# Altium schematic sheet Sheet0.SchDoc
size A4
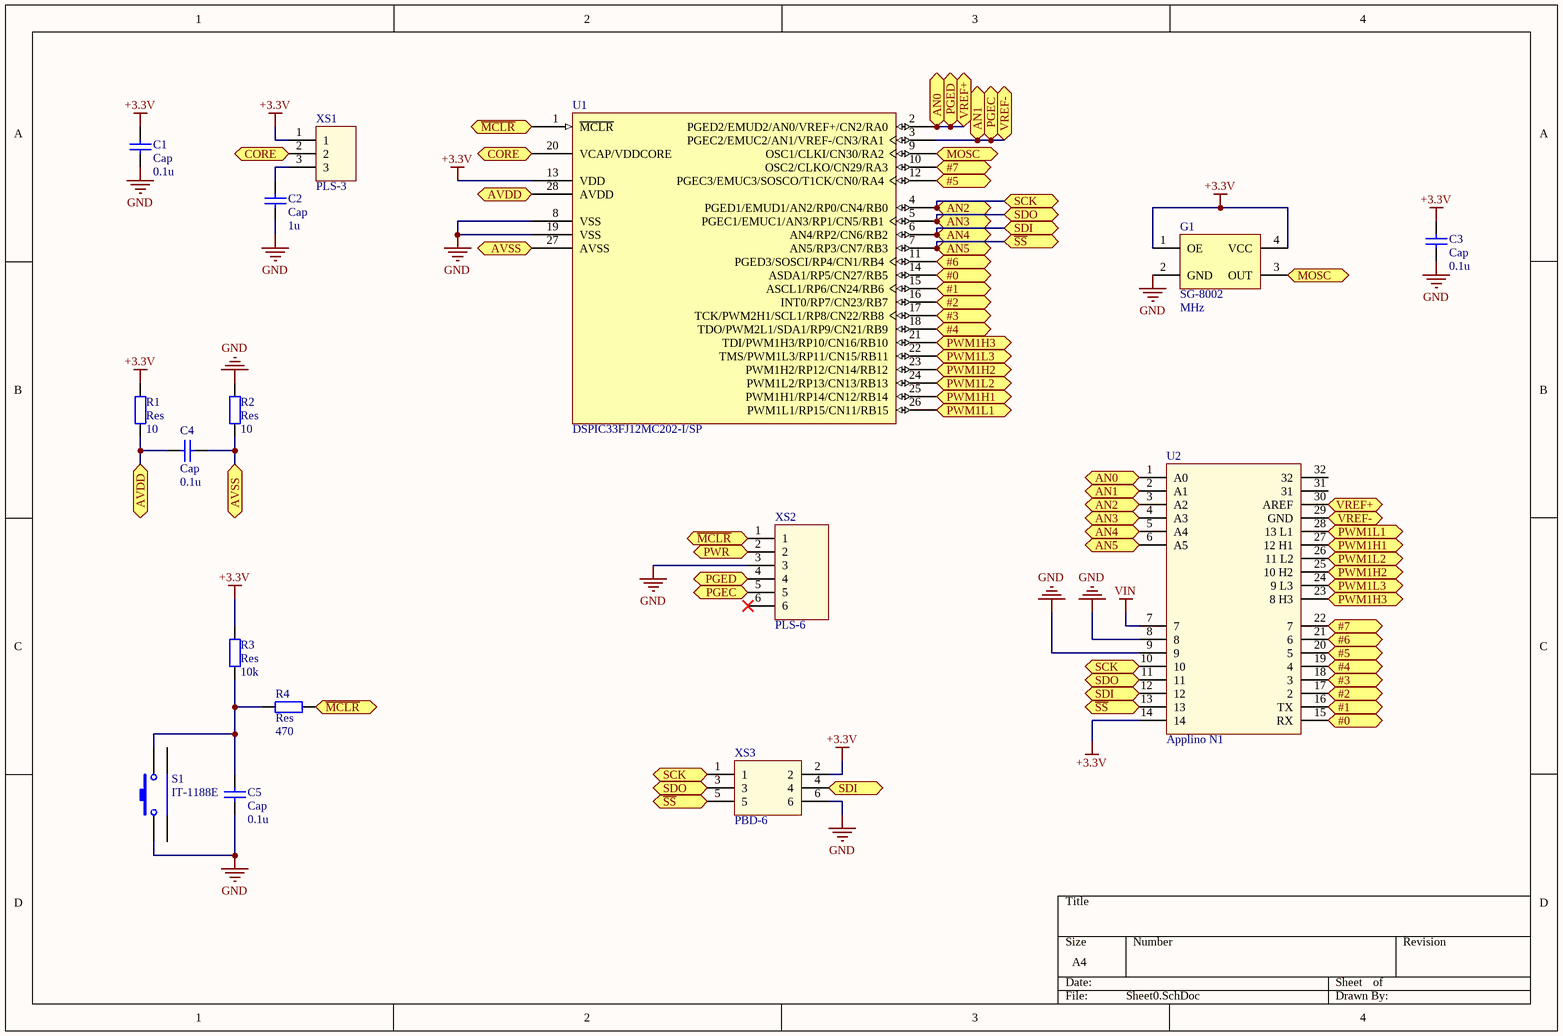
[diagram p0: Sheet0.SchDoc]

## Parts
C1  Cap  value 0.1u  [0805]
C2  Cap  value 1u  [0805]
C3  Cap  value 0.1u  [0805]
C4  Cap  value 0.1u  [0805]
C5  Cap  value 0.1u  [0805]
G1  SG-8002  Frequency: MHz  [SMD7050]
R1  Res  value 10  [0805]
R2  Res  value 10  [0805]
R3  Res  value 10k  [0805]
R4  Res  value 470  [0805]
S1  IT-1188E  [IT-1188E]
U1  DSPIC33FJ12MC202-I/SP  [SPDIP300-SP28]
U2  Applino N1  [N1]
XS1  PLS-3  [PLS-3]
XS2  PLS-6  [PLS-6]
XS3  PBD-6  [PBD-6]

## Ports
#0, #1, #2, #3, #4, #5, #6, #7, AN0, AN1, AN2, AN3, AN4, AN5, AVDD, AVSS, CORE, MOSC, PGEC, PGED, PWM1H1, PWM1H2, PWM1H3, PWM1L1, PWM1L2, PWM1L3, PWR, SCK, SDI, SDO, VREF+, VREF-, ~{MCLR}, ~{SS}

## Nets
+3.3V: C1.2 C3.2 G1.1(OE) G1.4(VCC) R1.2 R3.2 U1.13(VDD) U2.14 XS1.1 XS3.2
GND: C1.1 C2.1 C3.1 C5.1 G1.2(GND) R2.2 S1.1 U1.8(VSS) U1.19(VSS) U2.8 U2.9 XS2.3 XS3.6
VIN: U2.7
#0: U1.14(ASDA1/RP5/CN27/RB5) U2.15(RX) ; port #0
#1: U1.15(ASCL1/RP6/CN24/RB6) U2.16(TX) ; port #1
#2: U1.16(INT0/RP7/CN23/RB7) U2.17(2) ; port #2
#3: U1.17(TCK/PWM2H1/SCL1/RP8/CN22/RB8) U2.18(3) ; port #3
#4: U1.18(TDO/PWM2L1/SDA1/RP9/CN21/RB9) U2.19(4) ; port #4
#5: U1.12(PGEC3/EMUC3/SOSCO/T1CK/CN0/RA4) U2.20(5) ; port #5
#6: U1.11(PGED3/SOSCI/RP4/CN1/RB4) U2.21(6) ; port #6
#7: U1.10(OSC2/CLKO/CN29/RA3) U2.22(7) ; port #7
AN0: U1.2(PGED2/EMUD2/AN0/VREF+/CN2/RA0) U2.1(A0) U2.30(AREF) XS2.4 ; port PGED, port AN0, port VREF+
AN1: U1.3(PGEC2/EMUC2/AN1/VREF-/CN3/RA1) U2.2(A1) U2.29(GND) XS2.5 ; port PGEC, port AN1, port VREF-
AN2: U1.4(PGED1/EMUD1/AN2/RP0/CN4/RB0) U2.3(A2) U2.10 XS3.1 ; port AN2, port SCK
AN3: U1.5(PGEC1/EMUC1/AN3/RP1/CN5/RB1) U2.4(A3) U2.11 XS3.3 ; port AN3, port SDO
AN4: U1.6(AN4/RP2/CN6/RB2) U2.5(A4) U2.12 XS3.4 ; port AN4, port SDI
AN5: U1.7(AN5/RP3/CN7/RB3) U2.6(A5) U2.13 XS3.5 ; port AN5, port ~{SS}
AVDD: C4.2 R1.1 U1.28(AVDD) ; port AVDD
AVSS: C4.1 R2.1 U1.27(AVSS) ; port AVSS
CORE: U1.20(VCAP/VDDCORE) XS1.2 ; port CORE
~{MCLR}: R4.1 U1.1(~{MCLR}) XS2.1 ; port ~{MCLR}
MOSC: G1.3(OUT) U1.9(OSC1/CLKI/CN30/RA2) ; port MOSC
PWM1H1: U1.25(PWM1H1/RP14/CN12/RB14) U2.27(12_H1) ; port PWM1H1
PWM1H2: U1.23(PWM1H2/RP12/CN14/RB12) U2.25(10_H2) ; port PWM1H2
PWM1H3: U1.21(TDI/PWM1H3/RP10/CN16/RB10) U2.23(8_H3) ; port PWM1H3
PWM1L1: U1.26(PWM1L1/RP15/CN11/RB15) U2.28(13_L1) ; port PWM1L1
PWM1L2: U1.24(PWM1L2/RP13/CN13/RB13) U2.26(11_L2) ; port PWM1L2
PWM1L3: U1.22(TMS/PWM1L3/RP11/CN15/RB11) U2.24(9_L3) ; port PWM1L3
PWR: XS2.2 ; port PWR
NetC2_2: C2.2 XS1.3
NetC5_2: C5.2 R3.1 R4.2 S1.2

Not connected (* = marked no-connect by the designer): S1 3 4; U2 31 32; XS2 6*

## Library data of the parts
U1 = DSPIC33FJ12MC202-I/SP: High-Performance 16-bit Digital Signal Controller, 12 KB Flash, 1 KB RAM, 28-Pin SPDIP, Industrial Temperature; Manufacturer: Microchip; DatasheetVersion: revD, Jun-2009; PackageVersion: revBB, Aug-2009; PackageReference: SPDIP300-SP28; PackageDescription: 28-Lead Skinny Plastic Dual In-Line (SP) - 300 mil Body [SPDIP]; Supplier 1: Digi-Key; Supplier Part Number 1: DSPIC33FJ12MC202-I/SP-ND; Supplier 2: Farnell; Supplier Part Number 2: 1439610; Supplier 3: Newark; Supplier Part Number 3: 88K3899; Supplier 4: Mouser; Supplier Part Number 4: 579-DSPICJ12MC202ISP; Mounting Technology: Through Hole; PartNumber: DSPIC33FJ12MC202-I/SP; ComponentLink1Description: Manufacturer URL; ComponentLink1URL: http://www.microchip.com/; ComponentLink2Description: Datasheet; ComponentLink2URL: http://ww1.microchip.com/downloads/en/DeviceDoc/70265D.pdf; ComponentLink3Description: Package Specification; ComponentLink3URL: http://www.microchip.com/stellent/groups/techpub_sg/documents/packagingspec/en012702.pdf